# Altium schematic sheet ESD_DWNSTRM.SchDoc
size A4; SheetNumber: 4; SheetTotal: 6
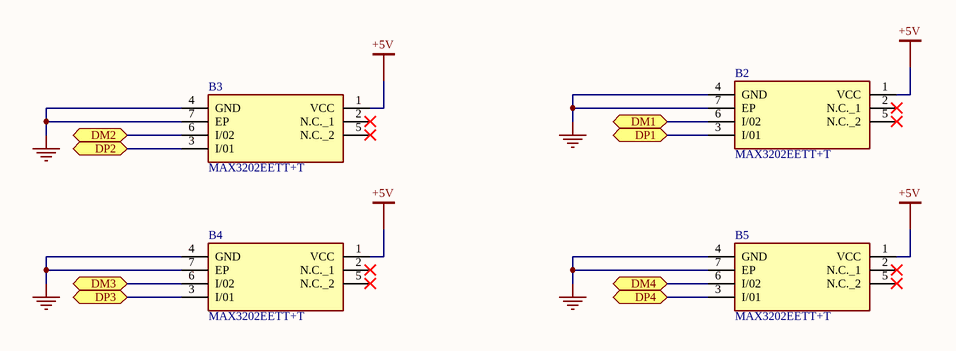
[diagram p0: ESD_DWNSTRM.SchDoc]

## Parts
B2  MAX3202EETT+T  [SON95P300X300X80-7N]
B3  MAX3202EETT+T  [SON95P300X300X80-7N]
B4  MAX3202EETT+T  [SON95P300X300X80-7N]
B5  MAX3202EETT+T  [SON95P300X300X80-7N]

## Ports
DM1 (bidir), DM2 (bidir), DM3 (bidir), DM4 (bidir), DP1 (bidir), DP2 (bidir), DP3 (bidir), DP4 (bidir)

## Nets
+5V: B2.1(VCC) B3.1(VCC) B4.1(VCC) B5.1(VCC)
GND: B2.4(GND) B2.7(EP) B3.4(GND) B3.7(EP) B4.4(GND) B4.7(EP) B5.4(GND) B5.7(EP)
DM1: B2.6(I/02) ; port DM1
DM2: B3.6(I/02) ; port DM2
DM3: B4.6(I/02) ; port DM3
DM4: B5.6(I/02) ; port DM4
DP1: B2.3(I/01) ; port DP1
DP2: B3.3(I/01) ; port DP2
DP3: B4.3(I/01) ; port DP3
DP4: B5.3(I/01) ; port DP4

Not connected (* = marked no-connect by the designer): B2 2(N.C._1)* 5(N.C._2)*; B3 2(N.C._1)* 5(N.C._2)*; B4 2(N.C._1)* 5(N.C._2)*; B5 2(N.C._1)* 5(N.C._2)*

## Library data of the parts
B2-B5 = MAX3202EETT+T: ESD Suppressors / TVS Diodes Low-Capacitance, 2/3/4/6-Channel, 15kV ESD-Protection Arrays for High-Speed Data Interfaces; Manufacturer_Name: Analog Devices; Geometry.Height: 0.8mm; Mouser Part Number: 700-MAX3202EETTT; Mouser Price/Stock: https://www.mouser.co.uk/ProductDetail/Analog-Devices-Maxim-Integrated/MAX3202EETT%2bT?qs=8wHch9UpSvZOsR663CaSvw%3D%3D; Manufacturer_Part_Number: MAX3202EETT+T; Datasheet Link: https://pdfserv.maximintegrated.com/en/ds/MAX3202E-MAX3206E.pdf